# EAGLE design placa(1) (EAGLE 9.5.1)
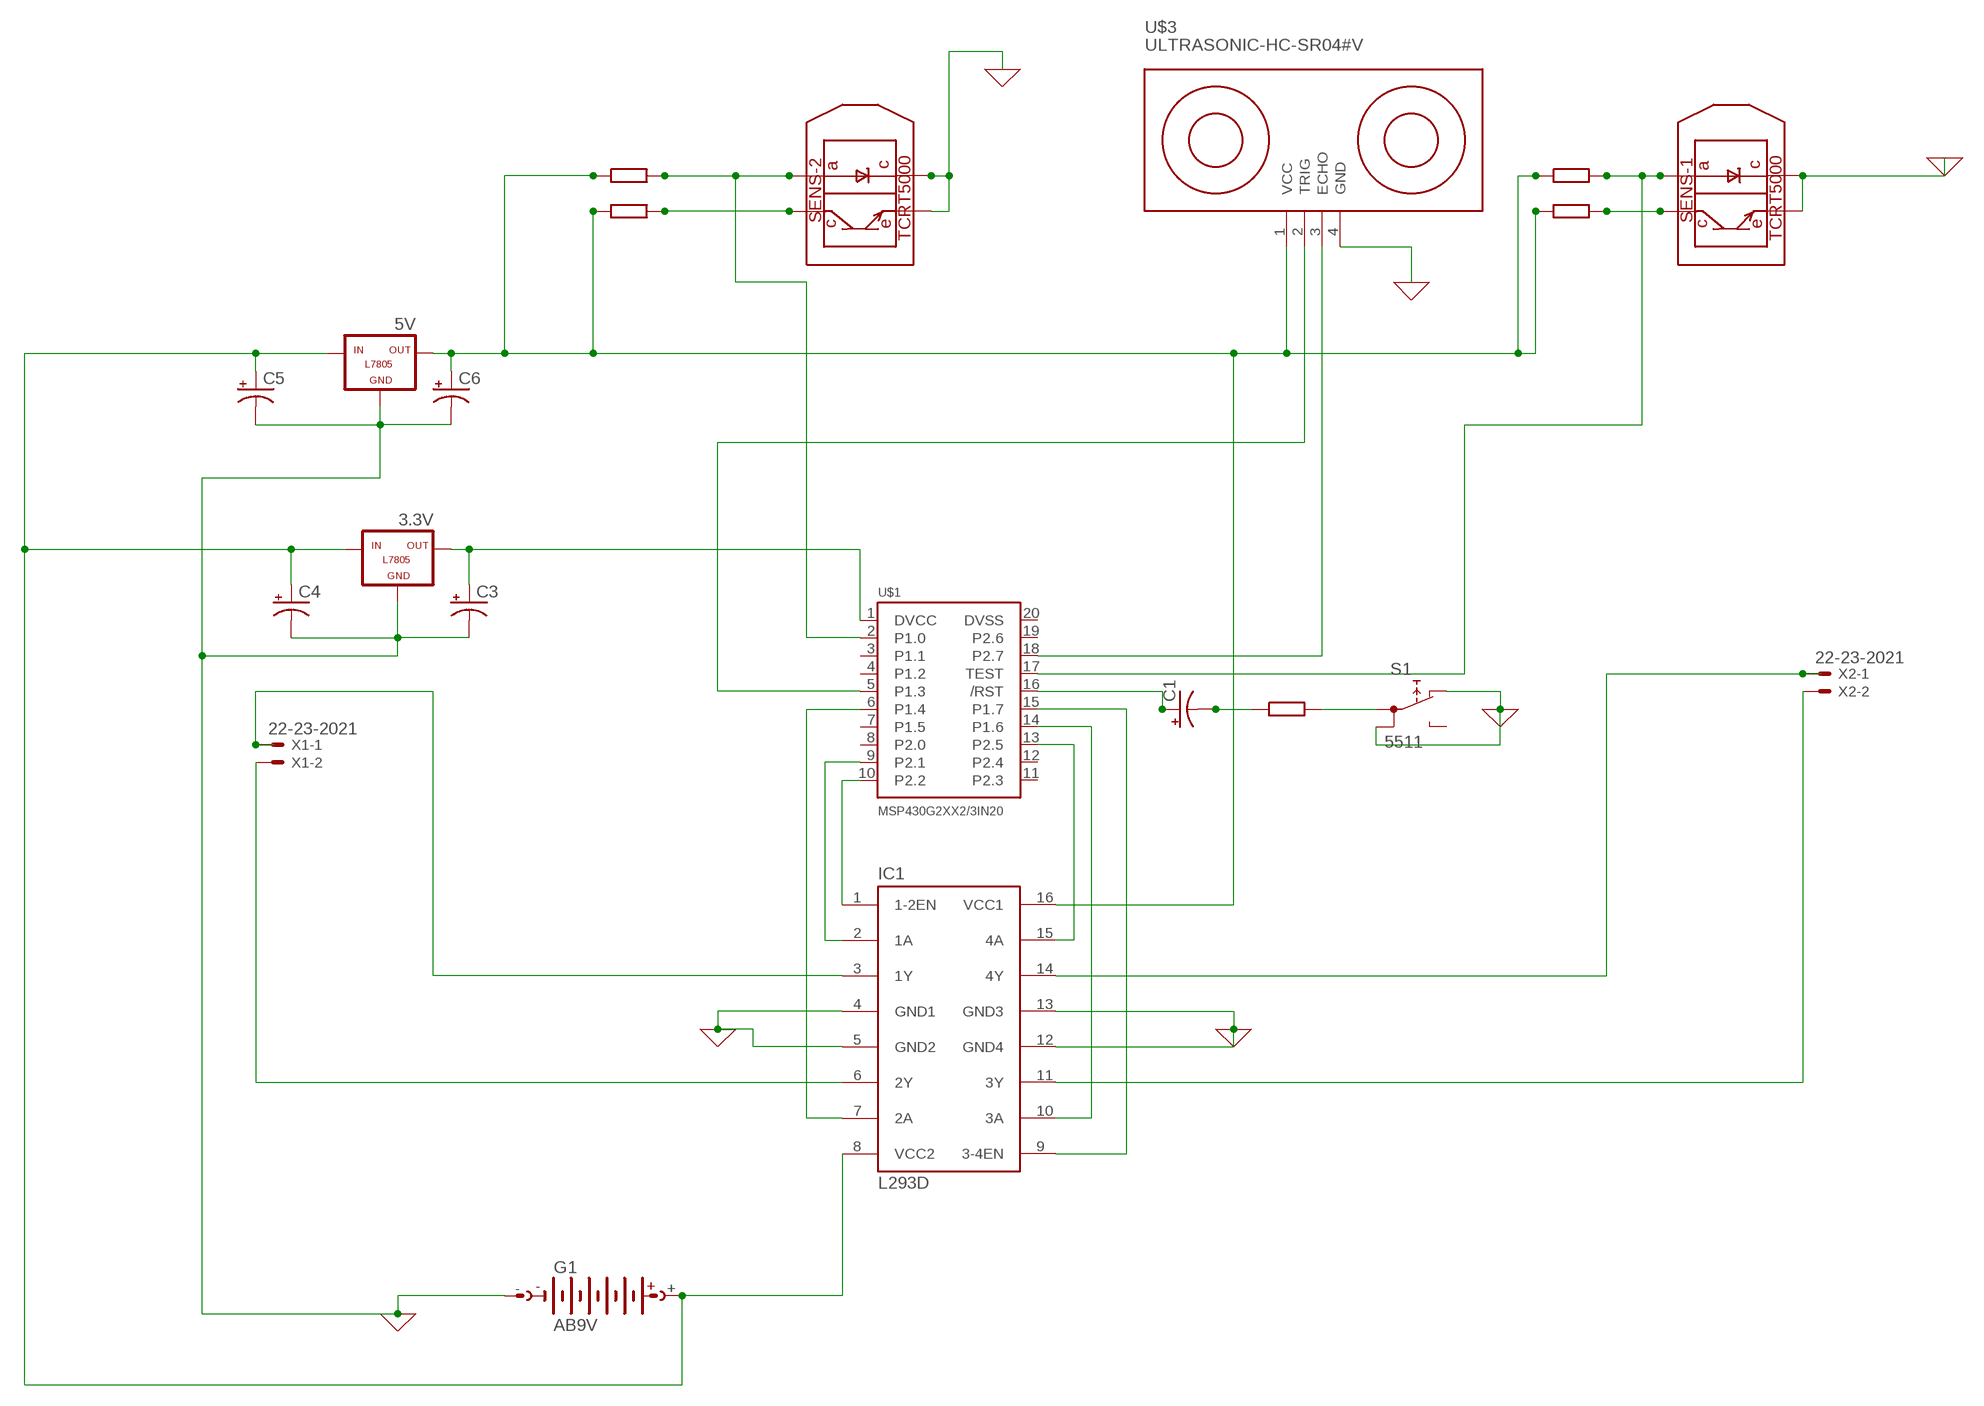
[diagram p0: schematic, sheet 1]

## Parts
3.3V  -L7805  [L7805]
5V  -L7805  [L7805]
C1  CPOL-US085CS-1R  [085CS_1R]
C3  CPOL-US085CS-1R  [085CS_1R]
C4  CPOL-US085CS-1R  [085CS_1R]
C5  CPOL-US085CS-1R  [085CS_1R]
C6  CPOL-US085CS-1R  [085CS_1R]
G1  AB9V  [AB9V]
IC1  L293D  [DIL16]
S1  5511  [5511]
SENS-1  TCRT5000  [5000]
SENS-2  TCRT5000  [5000]
U$1  MSP430G2XX2/3IN20  [DIL20]
U$3  ULTRASONIC-HC-SR04#V  [ULTRASONIC-HC-SR04#V]
X1  22-23-2021  [22-23-2021]
X2  22-23-2021  [22-23-2021]

## Nets
0: 3.3V.GND 5V.GND C3.- C4.- C5.- C6.- G1.- IC1.4(GND1) IC1.5(GND2) IC1.12(GND4) IC1.13(GND3) S1.1B S1.NC SENS-1.P$2 SENS-1.P$4 SENS-2.P$2 SENS-2.P$4 U$3.4(GND) ; supply symbol labelled GND
N$1: 3.3V.OUT C3.+ U$1.1(DVCC)
N$2: C1.+ U$1.16(/RST)
N$3: IC1.1(1-2EN) U$1.10(P2.2)
N$4: IC1.2(1A) U$1.9(P2.1)
N$5: IC1.7(2A) U$1.6(P1.4)
N$6: SENS-1.P$3 U$1.17(TEST)
N$7: IC1.3(1Y) X1.1
N$8: IC1.15(4A) U$1.13(P2.5)
N$9: IC1.10(3A) U$1.14(P1.6)
N$10: IC1.9(3-4EN) U$1.15(P1.7)
N$11: IC1.11(3Y) X2.2
N$12: SENS-2.P$3 U$1.2(P1.0)
N$13: IC1.6(2Y) X1.2
N$14: C1.-
N$15: IC1.14(4Y) X2.1
N$16: 5V.OUT C6.+ IC1.16(VCC1) U$3.1(VCC)
N$17: SENS-2.P$1
N$18: 3.3V.IN 5V.IN C4.+ C5.+ G1.+ IC1.8(VCC2)
N$19: S1.1A
N$20: SENS-1.P$1
N$22: U$1.5(P1.3) U$3.2(TRIG)
N$23: U$1.18(P2.7) U$3.3(ECHO)
Unconnected: S1.NO U$1.3(P1.1) U$1.4(P1.2) U$1.7(P1.5) U$1.8(P2.0) U$1.11(P2.3) U$1.12(P2.4) U$1.19(P2.6)

## Power pins joined to a net without a drawn wire
DVSS: U$1.20(DVSS)

## Library data of the parts
3.3V 5V = tango:-L7805
C1 C3-C6 = rcl:CPOL-US: POLARIZED CAPACITOR, American symbol; SPICEPREFIX: C
G1 = battery:AB9V: 9-V BATTERY CLIP
IC1 = st-microelectronics:L293D: PUSH-PULL 4 CHANNEL DRIVER; MPN: L293D; OC_FARNELL: 9589619; OC_NEWARK: 56P8249
S1 = switch:55?: PUSHBUTTON SERIES 5500 SWITCHES Source: www.e-switch.com .. 5500.pdf
SENS-1 SENS-2 = qfm-trx1-24g:TCRT5000: Reflective Optical Sensor with Transistor Output. Vishay Semiconductors
U$1 = ti_msp430gxxx:MSP430G2XX2/3: Mixed Signal Microcontroller MSP430 Value Line MSP430G2432: 1x EEM, 8 KiB Flash Memory, 256 B RAM, 1x Timer_A, 1x USI, 8x ADC10 Ch, 16x I/O MSP430G2332: 1x EEM, 4 KiB Flash Memory, 256 B RAM, 1x Timer_A, 1x USI, 8x ADC10 Ch, 16x I/O MSP430G2232: 1x EEM, 2 KiB Flash Memory, 256 B RAM, 1x Timer_A, 1x USI, 8x ADC10 Ch, 16x I/O MSP430G2132: 1x EEM, 1 KiB Flash Memory, 128 B RAM, 1x Timer_A, 1x USI, 8x ADC10 Ch, 16x I/O MSP430G2402: 1x EEM, 8 KiB Flash Memory, 256 B RAM, 1x Timer_A, 1x USI, 16x I/O MSP430G2302: 1x EEM, 4 KiB Flash Memory, 256 B RAM, 1x Timer_A, 1x USI, 16x I/O MSP430G2202: 1x EEM, 2 KiB Flash Memory, 256 B RAM, 1x Timer_A, 1x USI, 16x I/O MSP430G2102: 1x EEM, 1 KiB Flash Memory, 128 B RAM, 1x Timer_A, 1x USI, 16x I/O MSP430G2452: 1x EEM, 8 KiB Flash Memory, 256 B RAM, 1x Timer_A, 8x Comp_A Ch, 1x USI, 8x ADC10 Ch, 16x I/O MSP430G2352: 1x EEM, 4 KiB Flash Memory, 256 B RAM, 1x Timer_A, 8x Comp_A Ch, 1x USI, 8x ADC10 Ch, 16x I/O MSP430G2252: 1x EEM, 2 KiB Flash Memory, 256 B RAM, 1x Timer_A, 8x Comp_A Ch, 1x USI, 8x ADC10 Ch, 16x I/O MSP430G2152: 1x EEM, 1 KiB Flash Memory, 128 B RAM, 1x Timer_A, 8x Comp_A Ch, 1x USI, 8x ADC10 Ch, 16x I/O MSP430G2412: 1x EEM, 8 KiB Flash Memory, 256 B RAM, 1x Timer_A, 8x Comp_A Ch, 1x USI, 16x I/O MSP430G2312: 1x EEM, 4 KiB Flash Memory, 256 B RAM, 1x Timer_A, 8x Comp_A Ch, 1x USI, 16x I/O MSP430G2212: 1x EEM, 2 KiB Flash Memory, 256 B RAM, 1x Timer_A, 8x Comp_A Ch, 1x USI, 16x I/O MSP430G2112: 1x EEM, 1 KiB Flash Memory, 128 B RAM, 1x Timer_A, 8x Comp_A Ch, 1x USI, 16x I/O MSP430G2533: 1x BSL, 1x EEM, 16 KiB Flash Memory, 512 B RAM, 2x Timer_A, 8x ADC10 Ch, 1x USCI A0/B0, 16x I/O MSP430G2433: 1x BSL, 1x EEM, 8 KiB Flash Memory, 512 B RAM, 2x Timer_A, 8x ADC10 Ch, 1x USCI A0/B0, 16x I/O MSP430G2333: 1x BSL, 1x EEM, 4 KiB Flash Memory, 256 B RAM, 2x Timer_A, 8x ADC10 Ch, 1x USCI A0/B0, 16x I/O MSP430G2233: 1x BSL, 1x EEM, 2 KiB Flash Memory, 256 B RAM, 2x Timer_A, 8x ADC10 Ch, 1x USCI A0/B0, 16x I/O MSP430G2403: 1x BSL, 1x EEM, 8 KiB Flash Memory, 512 B RAM, 2x Timer_A, 1x USCI A0/B0, 16x I/O MSP430G2303: 1x BSL, 1x EEM, 4 KiB Flash Memory, 256 B RAM, 2x Timer_A, 1x USCI A0/B0, 16x I/O MSP430G2203: 1x BSL, 1x EEM, 2 KiB Flash Memory, 256 B RAM, 2x Timer_A, 1x USCI A0/B0, 16x I/O MSP430G2553: 1x BSL, 1x EEM, 16 KiB Flash Memory, 512 B RAM, 2x Timer_A, 8x Comp_A+ Ch, 8x ADC10 Ch, 1x USCI A0/B0, 16x I/O MSP430G2453: 1x BSL, 1x EEM, 8 KiB Flash Memory, 512 B RAM, 2x Timer_A, 8x Comp_A+ Ch, 8x ADC10 Ch, 1x USCI A0/B0, 16x I/O MSP430G2353: 1x BSL, 1x EEM, 4 KiB Flash Memory, 256 B RAM, 2x Timer_A, 8x Comp_A+ Ch, 8x ADC10 Ch, 1x USCI A0/B0, 16x I/O MSP430G2253: 1x BSL, 1x EEM, 2 KiB Flash Memory, 256 B RAM, 2x Timer_A, 8x Comp_A+ Ch, 8x ADC10 Ch, 1x USCI A0/B0, 16x I/O MSP430G2153: 1x BSL, 1x EEM, 1 KiB Flash Memory, 256 B RAM, 2x Timer_A, 8x Comp_A+ Ch, 8x ADC10 Ch, 1x USCI A0/B0, 16x I/O MSP430G2513: 1x BSL, 1x EEM, 16 KiB Flash Memory, 512 B RAM, 2x Timer_A, 8x Comp_A+ Ch, 1x USCI A0/B0, 16x I/O MSP430G2413: 1x BSL, 1x EEM, 8 KiB Flash Memory, 512 B RAM, 2x Timer_A, 8x Comp_A+ Ch, 1x USCI A0/B0, 16x I/O MSP430G2313: 1x BSL, 1x EEM, 4 KiB Flash Memory, 256 B RAM, 2x Timer_A, 8x Comp_A+ Ch, 1x USCI A0/B0, 16x I/O MSP430G2213: 1x BSL, 1x EEM, 2 KiB Flash Memory, 256 B RAM, 2x Timer_A, 8x Comp_A+ Ch, 1x USCI A0/B0, 16x I/O MSP430G2113: 1x BSL, 1x EEM, 1 KiB Flash Memory, 256 B RAM, 2x Timer_A, 8x Comp_A+ Ch, 1x USCI A0/B0, 16x I/O
U$3 = diy-modules:ULTRASONIC-HC-SR04: Ultrasonic Ranging Module HC-SR04 More details available here: http://randomnerdtutorials.com/complete-guide-for-ultrasonic-sensor-hc-sr04/ Click here to find device on ebay.com <http://www.ebay.com/sch/hc+sr04+ultrasonic>
X1 X2 = con-molex:22-23-2021: .100" (2.54mm) Center Header - 2 Pin; MF: MOLEX; MPN: 22-23-2021; OC_FARNELL: 1462926; OC_NEWARK: 25C3832

## Board
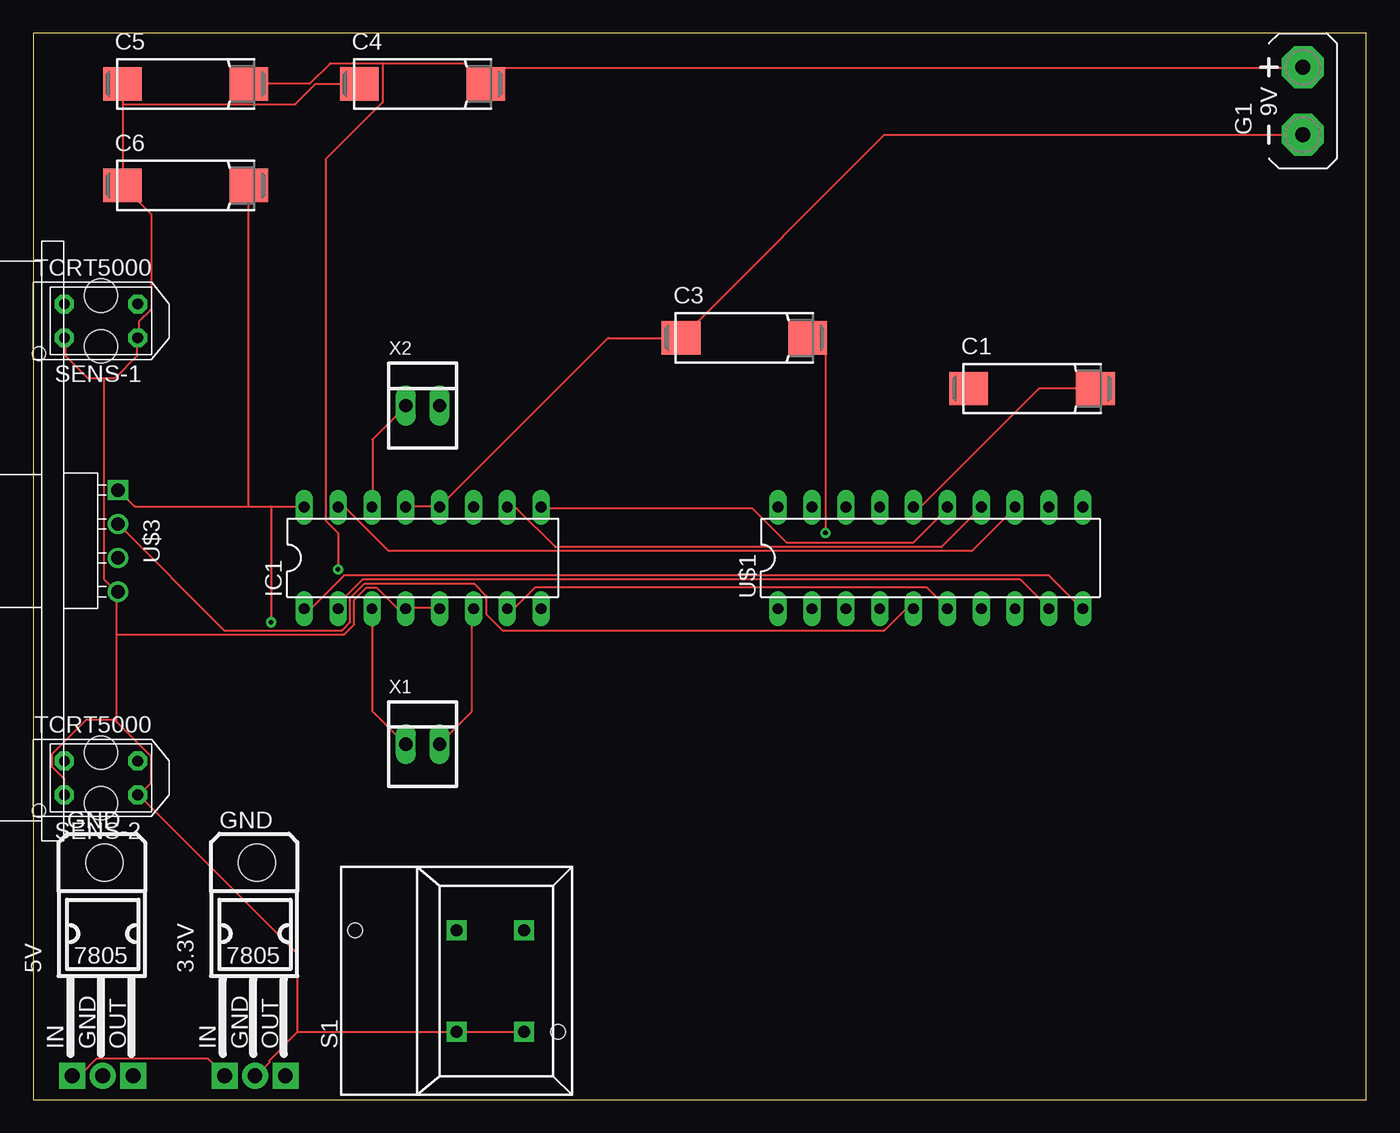
[diagram p1: board, top side]
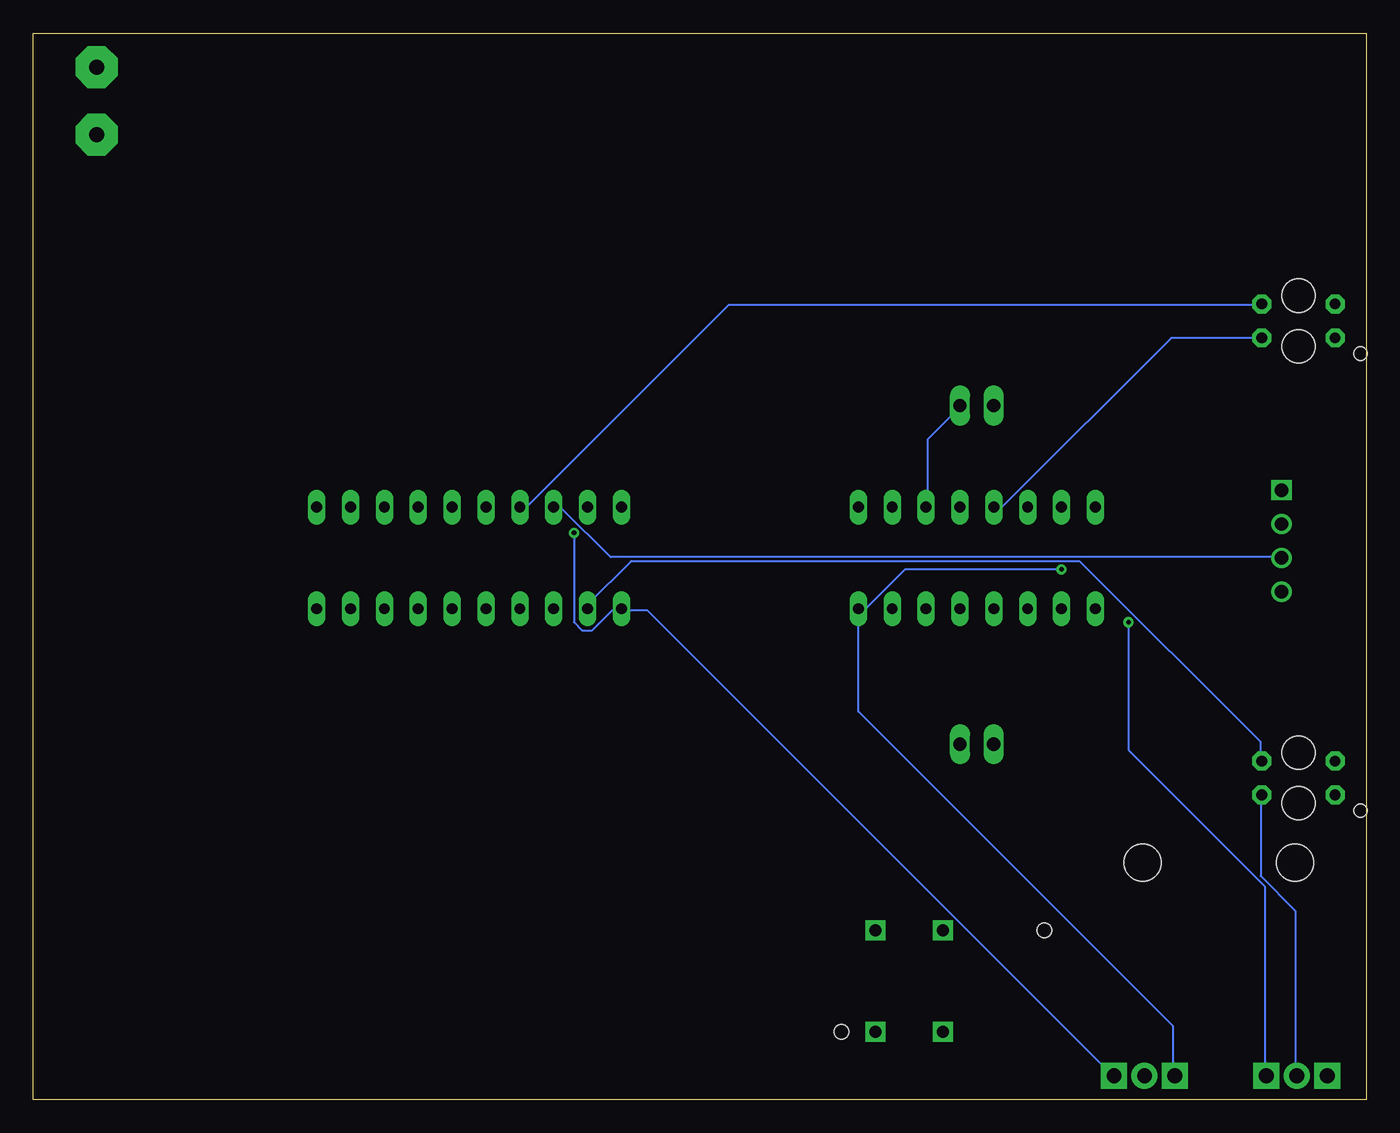
[diagram p2: board, bottom side, seen from below]

Size 100 x 80 mm. Coordinates in mm from the lower left corner, seen from the top.
Outline: 0,0 100,0 100,80 0,80 0,0
Copper layers (1*16): Top 0.035mm / dielectric 1.5mm / Bottom 0.035mm
Design rules "default": minimum track width 6mil, minimum drill 0.35mm, track to track 6mil, track to pad 6mil, pad to pad 6mil, via to via 6mil, smd to smd 6mil, copper to edge 40mil, drill to drill 6mil, minimum pad ring 10mil, minimum via ring 8mil, stop-mask expansion 4mil, vias tented up to drill 0mil, thermal gap 10mil

### Footprints (pad centres in the part's own frame; a part is rotated, then mirrored left to right if it is on the bottom)
L7805 = drill 1.1 pad 1.93: GND 0.127,-9.652 | drill 1.1 pad 1.93 square: IN -2.159,-9.652; OUT 2.413,-9.652 | hole 2.8: 0.254,6.35
085CS_1R = smd 2.9 x 2.5: + 4.75,0; - -4.75,0
AB9V = drill 1.118 pad 3.15 octagon: + 0,2.54; - 0,-2.54
DIL16 = drill 0.813 long: 1 -8.89,-3.81; 2 -6.35,-3.81; 3 -3.81,-3.81; 4 -1.27,-3.81; 5 1.27,-3.81; 6 3.81,-3.81; 7 6.35,-3.81; 8 8.89,-3.81; 9 8.89,3.81; 10 6.35,3.81; 11 3.81,3.81; 12 1.27,3.81; 13 -1.27,3.81; 14 -3.81,3.81; 15 -6.35,3.81; 16 -8.89,3.81
5511 = drill 0.9 pad 1.5 square: 1A 0,3.81; 1B 0,-3.81; NC 5.08,-3.81; NO 5.08,3.81 | hole 1.1: -7.62,3.81; 7.62,-3.81
5000 = drill 0.8 pad 1.422 octagon: P$1 -2.75,1.27; P$2 -2.75,-1.27; P$3 2.75,1.27; P$4 2.75,-1.27 | hole 2.5: 0,1.9; 0,-1.9 | hole 1: -4.65,-2.45
DIL20 = drill 0.813 long: 1 -11.43,-3.81; 2 -8.89,-3.81; 3 -6.35,-3.81; 4 -3.81,-3.81; 5 -1.27,-3.81; 6 1.27,-3.81; 7 3.81,-3.81; 8 6.35,-3.81; 9 8.89,-3.81; 10 11.43,-3.81; 11 11.43,3.81; 12 8.89,3.81; 13 6.35,3.81; 14 3.81,3.81; 15 1.27,3.81; 16 -1.27,3.81; 17 -3.81,3.81; 18 -6.35,3.81; 19 -8.89,3.81; 20 -11.43,3.81
ULTRASONIC-HC-SR04#V = drill 1 square: 1 -3.81,0 | drill 1: 2 -1.27,0; 3 1.27,0; 4 3.81,0
22-23-2021 = drill 1 long: 1 -1.27,0; 2 1.27,0

### Placement (x,y rotation side)
3.3V  16.51,11.43 0 top
5V  5.08,11.43 0 top
C1  74.93,53.34 0 top
C3  53.34,57.15 0 top
C4  29.21,76.2 0 top
C5  11.43,76.2 0 top
C6  11.43,68.58 0 top
G1  95.25,74.93 0 top
IC1  29.21,40.64 0 top
S1  31.75,8.89 0 top
SENS-1  5.08,58.42 0 top
SENS-2  5.08,24.13 0 top
U$1  67.31,40.64 0 top
U$3  6.35,41.91 270 top
X1  29.21,26.67 0 top
X2  29.21,52.07 0 top

### Tracks (layer width: path | path; a pad name or v marks a point on that pad's centre or on a via)
0
  Top 0.152: 30.48,44.5 28.04,44.5 IC1.13 | 30.48,44.5 43.13,57.15 C3.- 48.62,57.15 63.86,72.39 G1.- | 30.48,44.5 IC1.12 | 5.33,54.1 6.1,54.1 7.77,55.78 7.77,57.15 SENS-1.P$4 7.92,57.15 7.92,58.37 8.84,59.28 8.84,66.45 6.71,68.58 | 5.33,54.1 4.12,54.1 2.44,55.78 2.44,57.15 SENS-1.P$2 | 6.71,74.68 6.71,76.2 C5.- | 6.71,74.68 6.71,68.58 | C4.- 21.18,76.2 19.66,74.68 6.71,74.68 | 6.71,68.58 C6.- | S1.NC 36.73,5.03 31.85,5.03 S1.1B 31.7,5.03 19.81,5.03 | 19.81,5.03 17.68,2.9 17.68,2.74 16.76,1.83 3.3V.GND | IC1.5 30.48,36.88 28.04,36.88 IC1.4 27.89,36.88 27.28,36.88 25.76,38.41 24.99,38.41 24.08,37.49 24.08,35.66 23.32,34.9 6.25,34.9 | 6.25,28.35 8.84,25.76 8.84,23.77 7.92,22.86 | 6.25,28.35 6.1,28.5 3.96,28.5 1.37,25.91 1.37,24.99 2.29,24.08 2.29,22.86 SENS-2.P$2 | 6.25,28.35 6.25,34.9 | 6.25,34.9 6.25,38.1 | 19.81,5.03 19.81,10.97 7.92,22.86 | 7.92,22.86 SENS-2.P$4 | 5.33,54.1 5.33,39.01 6.25,38.1 | 6.25,38.1 U$3.4
  Bottom 0.152: 5V.GND 5.33,1.83 5.33,14.17 7.92,16.76 7.92,22.86 SENS-2.P$4 | SENS-1.P$4 14.63,57.15 27.28,44.5 27.89,44.5 IC1.13
N$1  (via drill 0.35)
  Top 0.152: v59.44,42.52 59.44,55.93 58.22,57.15 C3.+
  Bottom 0.152: v59.44,42.52 59.44,35.81 58.83,35.2 58.06,35.2 56.54,36.73 55.93,36.73 U$1.1 55.78,36.73 53.95,36.73 19.05,1.83 3.3V.OUT
N$2
  Top 0.152: C1.+ 75.44,53.34 66.6,44.5 66.14,44.5 U$1.16
N$3
  Top 0.152: IC1.1 20.42,36.88 20.88,36.88 23.32,39.32 76.2,39.32 78.64,36.88 U$1.10
N$4
  Top 0.152: IC1.2 22.86,37.19 24.69,39.01 74.07,39.01 76.2,36.88 U$1.9
N$5
  Top 0.152: IC1.7 35.66,36.88 36.12,36.88 37.64,38.41 67.06,38.41 68.58,36.88 U$1.6
N$6
  Bottom 0.152: U$1.17 63.4,44.5 62.94,44.5 47.85,59.59 7.92,59.59 SENS-1.P$3
N$7
  Top 0.152: IC1.3 25.45,36.73 25.45,29.11 27.89,26.67 X1.1
N$8
  Top 0.152: IC1.15 22.86,44.35 23.47,44.35 26.67,41.15 70.41,41.15 73.61,44.35 U$1.13
N$9
  Top 0.152: U$1.14 68.12,41.45 39.17,41.45 36.27,44.35 35.66,44.35 IC1.10
N$10
  Top 0.152: IC1.9 38.1,44.35 53.95,44.35 56.54,41.76 65.99,41.76 68.58,44.35 U$1.15
N$11
  Bottom 0.152: IC1.11 32.92,44.5 32.92,49.53 30.48,51.97 X2.2
N$12
  Bottom 0.152: U$1.2 58.37,36.88 58.37,37.19 55.17,40.39 21.49,40.39 7.92,26.82 7.92,25.45 SENS-2.P$3
N$13
  Top 0.152: X1.2 32.92,29.11 32.92,36.73 IC1.6
N$15
  Top 0.152: IC1.14 25.45,44.5 25.45,49.53 27.89,51.97 X2.1
N$16  (via drill 0.35)
  Top 0.152: 16.15,44.5 7.62,44.5 6.4,45.72 U$3.1 | 16.15,44.5 17.83,44.5 | 17.83,44.5 20.27,44.5 IC1.16 | 16.15,44.5 16.15,68.58 C6.+ | 17.83,44.5 v17.83,35.81
  Bottom 0.152: v17.83,35.81 17.83,26.21 7.62,16 7.62,1.83 5V.OUT
N$18  (via drill 0.35)
  Top 0.152: 5V.IN 3.05,1.83 3.5,1.83 4.72,3.05 13.11,3.05 14.33,1.83 3.3V.IN | C5.+ 20.73,76.2 22.25,77.72 26.21,77.72 | 26.21,77.72 32.31,77.72 33.83,76.2 C4.+ 33.98,76.2 35.2,77.42 95.25,77.42 G1.+ | v22.86,39.78 22.86,42.52 21.95,43.43 21.95,70.56 26.21,74.83 26.21,77.72
  Bottom 0.152: 3.3V.IN 14.48,1.83 14.48,5.49 38.1,29.11 IC1.8 38.1,36.88 37.49,36.88 34.59,39.78 v22.86,39.78
N$22
  Top 0.152: U$3.2 14.33,35.2 23.16,35.2 23.77,35.81 23.77,37.64 24.84,38.71 33.07,38.71 33.98,37.8 33.98,36.42 35.2,35.2 63.86,35.2 65.38,36.73 65.99,36.73 U$1.5
N$23
  Bottom 0.152: U$1.18 60.96,44.35 60.35,44.35 56.69,40.69 6.4,40.69 U$3.3